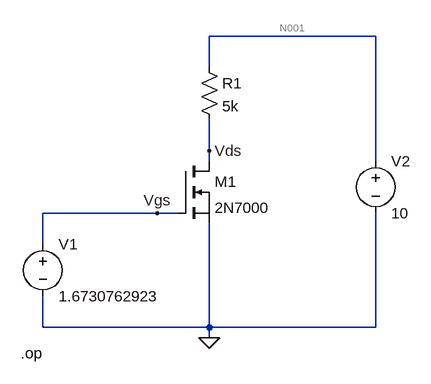
[diagram p0: schematic Circuito_MOSFET_Enrich_PuntoQ.asc]
Circuito_MOSFET_Enrich_PuntoQ.asc, the LTspice schematic file:
Version 4
SHEET 1 880 680
WIRE 448 -80 192 -80
WIRE 192 -32 192 -80
WIRE 192 96 192 48
WIRE 192 112 192 96
WIRE 448 112 448 -80
WIRE 112 192 -64 192
WIRE 144 192 112 192
WIRE -64 240 -64 192
WIRE -64 368 -64 320
WIRE 192 368 192 208
WIRE 192 368 -64 368
WIRE 448 368 448 192
WIRE 448 368 192 368
WIRE 192 384 192 368
FLAG 192 384 0
FLAG 192 96 Vds
FLAG 112 192 Vgs
SYMBOL nmos 144 112 R0
SYMATTR InstName M1
SYMATTR Value 2N7000
SYMBOL voltage -64 224 R0
WINDOW 123 0 0 Left 0
WINDOW 39 0 0 Left 0
SYMATTR InstName V1
SYMATTR Value 1.6730762923
SYMBOL voltage 448 96 R0
WINDOW 123 0 0 Left 0
WINDOW 39 0 0 Left 0
SYMATTR InstName V2
SYMATTR Value 10
SYMBOL res 176 -48 R0
SYMATTR InstName R1
SYMATTR Value 5k
TEXT -98 408 Left 2 !.op

The netlist it stands for:
* Circuito_MOSFET_Enrich_PuntoQ.asc
M1 Vds Vgs 0 0 2N7000
V1 Vgs 0 1.6730762923
V2 N001 0 10
R1 N001 Vds 5k
.model NMOS NMOS
.model PMOS PMOS
.lib standard.mos
.op
.backanno
.end

* Results of the author's LTspice run, read from the files saved beside the schematic
* Operating Point:
*   V(vds) = 4.659 V
*   V(vgs) = 1.673 V
*   V(n001) = 10 V
*   Id(M1) = 1.068 mA
*   Ig(M1) = -20.55 pA
*   Is(M1) = -1.068 mA
*   I(R1) = 1.068 mA
*   I(V1) = 0 A
*   I(V2) = -1.068 mA